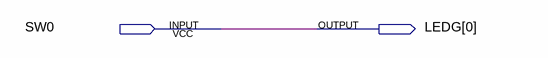
[diagram p0: schematic sheet]
// Quartus schematic test.bdf as structural Verilog: 0 symbols, 2 pins
module test (
  input  SW0,
  output [0:0] LEDG
);


  assign LEDG[0] = SW0;
endmodule
